# Altium schematic sheet logic6_front.SchDoc: mcHF QRP Transceiver UI board
size A4; Author: K Atanassov; CompanyName: M0NKA; Revision: 0.6.3; SheetTotal: 5
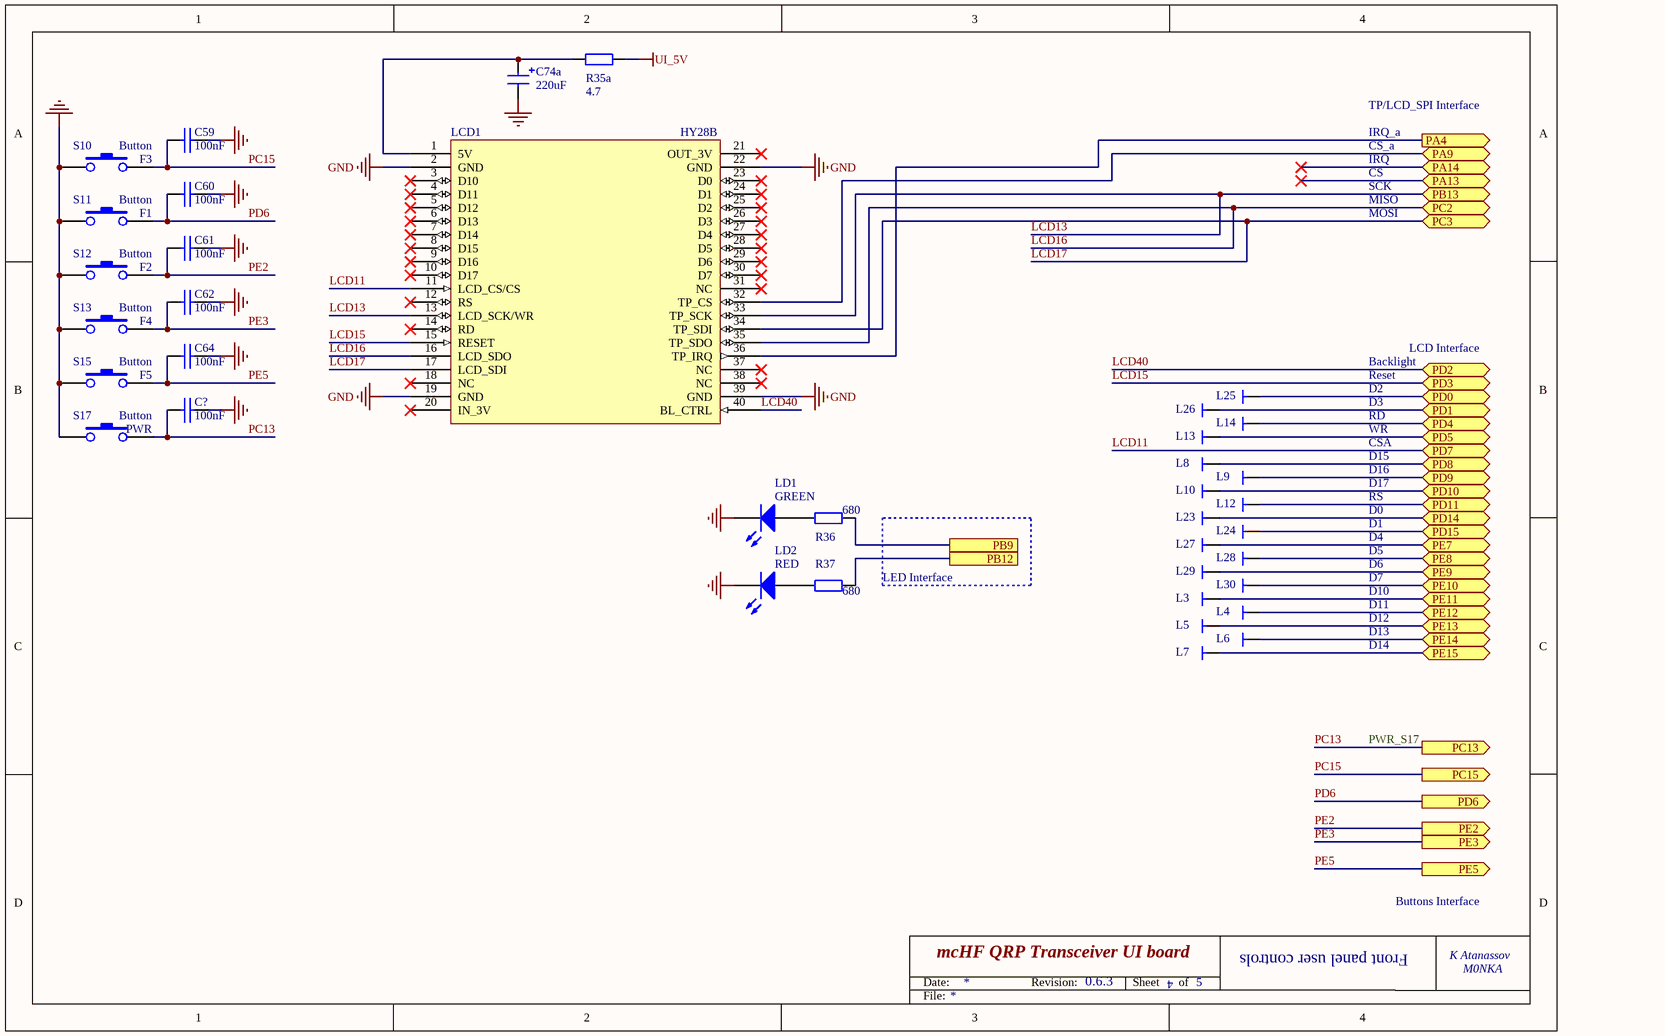
[diagram p0: logic6_front.SchDoc]

## Parts
C59  100nF  [0805-Pro]
C60  100nF  [0805-Pro]
C61  100nF  [0805-Pro]
C62  100nF  [0805-Pro]
C64  100nF  [0805-Pro]
C74a  220uF  [CAP_ALUM]
C?  100nF  [0805-Pro]
L3  TP  [tp]  (value not drawn)  (no BOM)
L4  TP  [tp]  (value not drawn)  (no BOM)
L5  TP  [tp]  (value not drawn)  (no BOM)
L6  TP  [tp]  (value not drawn)  (no BOM)
L7  TP  [tp]  (value not drawn)  (no BOM)
L8  TP  [tp]  (value not drawn)  (no BOM)
L9  TP  [tp]  (value not drawn)  (no BOM)
L10  TP  [tp]  (value not drawn)  (no BOM)
L12  TP  [tp]  (value not drawn)  (no BOM)
L13  TP  [tp]  (value not drawn)  (no BOM)
L14  TP  [tp]  (value not drawn)  (no BOM)
L23  TP  [tp]  (value not drawn)  (no BOM)
L24  TP  [tp]  (value not drawn)  (no BOM)
L25  TP  [tp]  (value not drawn)  (no BOM)
L26  TP  [tp]  (value not drawn)  (no BOM)
L27  TP  [tp]  (value not drawn)  (no BOM)
L28  TP  [tp]  (value not drawn)  (no BOM)
L29  TP  [tp]  (value not drawn)  (no BOM)
L30  TP  [tp]  (value not drawn)  (no BOM)
LCD1  HY28B  [HY28A]  (no BOM)
LD1  GREEN  [LED2n]
LD2  RED  [LED2n]
R35a  4.7  [1206]
R36  680  [0805-Pro]
R37  680  [0805-Pro]
S10  Button  Software function: F3  [BUTTON_SMD2]
S11  Button  Software function: F1  [BUTTON_SMD2]
S12  Button  Software function: F2  [BUTTON_SMD2]
S13  Button  Software function: F4  [BUTTON_SMD2]
S15  Button  Software function: F5  [BUTTON_SMD2]
S17  Button  Software function: PWR  [BUTTON_SMD2]

## Ports
PA4 (out), PA9 (bidir), PA13 (bidir), PA14 (bidir), PB9, PB12, PB13 (bidir), PC2 (bidir), PC3 (bidir), PC13 (out), PC15 (out), PD0 (bidir), PD1 (bidir), PD2 (bidir), PD3 (bidir), PD4 (bidir), PD5 (bidir), PD6 (out), PD7 (bidir), PD8 (bidir), PD9 (bidir), PD10 (bidir), PD11 (bidir), PD14 (bidir), PD15 (bidir), PE2 (out), PE3 (out), PE5 (out), PE7 (bidir), PE8 (bidir), PE9 (bidir), PE10 (bidir), PE11 (bidir), PE12 (bidir), PE13 (bidir), PE14 (bidir), PE15 (bidir)

## Nets
GND: C59.1 C60.1 C61.1 C62.1 C64.1 C74a.2 C?.1 LCD1.2(GND) LCD1.19(GND) LCD1.22(GND) LCD1.39(GND) LD1.2(K) LD2.2(K) S10.1 S11.1 S12.1 S13.1 S15.1 S17.1
UI_5V: R35a.1
LCD11: LCD1.11(LCD_CS/CS) ; port PD7
LCD13: LCD1.13(LCD_SCK/WR) LCD1.33(TP_SCK) ; port PB13
LCD15: LCD1.15(RESET) ; port PD3
LCD16: LCD1.16(LCD_SDO) LCD1.35(TP_SDO) ; port PC2
LCD17: LCD1.17(LCD_SDI) LCD1.34(TP_SDI) ; port PC3
LCD40: LCD1.40(BL_CTRL) ; port PD2
PA4: LCD1.36(TP_IRQ) ; port PA4
PA9: LCD1.32(TP_CS) ; port PA9
PB9: R36.2 ; port PB9
PB12: R37.2 ; port PB12
PC13: C?.2 S17.2 ; port PC13
PC15: C59.2 S10.2 ; port PC15
PD0: L25.1 ; port PD0
PD1: L26.1 ; port PD1
PD4: L14.1 ; port PD4
PD5: L13.1 ; port PD5
PD6: C60.2 S11.2 ; port PD6
PD8: L8.1 ; port PD8
PD9: L9.1 ; port PD9
PD10: L10.1 ; port PD10
PD11: L12.1 ; port PD11
PD14: L23.1 ; port PD14
PD15: L24.1 ; port PD15
PE2: C61.2 S12.2 ; port PE2
PE3: C62.2 S13.2 ; port PE3
PE5: C64.2 S15.2 ; port PE5
PE7: L27.1 ; port PE7
PE8: L28.1 ; port PE8
PE9: L29.1 ; port PE9
PE10: L30.1 ; port PE10
PE11: L3.1 ; port PE11
PE12: L4.1 ; port PE12
PE13: L5.1 ; port PE13
PE14: L6.1 ; port PE14
PE15: L7.1 ; port PE15
NetC74a_1: C74a.1 LCD1.1(5V) R35a.2
NetLD1_1: LD1.1(A) R36.1
NetLD2_1: LD2.1(A) R37.1

Not connected (* = marked no-connect by the designer): LCD1 3(D10)* 4(D11)* 5(D12)* 6(D13)* 7(D14)* 8(D15)* 9(D16)* 10(D17)* 12(RS)* 14(RD)* 18(NC)* 20(IN_3V)* 21(OUT_3V)* 23(D0)* 24(D1)* 25(D2)* 26(D3)* 27(D4)* 28(D5)* 29(D6)* 30(D7)* 31(NC)* 37(NC)* 38(NC)*

## Notes on the sheet
- TP/LCD_SPI Interface
- IRQ
- CS
- IRQ_a
- CS_a
- MISO
- MOSI
- SCK
- Backlight
- Reset
- LCD Interface
- CSA
- WR
- RD
- D2
- D3
- D16
- D15
- D17
- RS
- D0
- (near R37) LED Interface
- D1
- D4
- D5
- D6
- D7
- D10
- D12
- D11
- D13
- D14
- PWR_S17
- Buttons Interface
- 4
- Front panel user controls
- Date:
- Revision:
- Sheet
- of
- File:

## Library data of the parts
C59-C62 C64 C? = CAP: Capacitor; Order: FN 174-0673; QT Order: QCC-00154; Price: 0.068
C74a = CAP-POL: Electrolitic capacitor; Order: FN 225-4321; QT Order: QCC-00320; Price: 0.34
L3-L10 L12-L14 L23-L30 = TP: Test point
LCD1 = HY28AB: 2.8 inch TFT LCD
LD1 = LED2: LED 3mm; Order: FN 211-2096; Revision: July-2002: Re-released for DXP Platform.; Price: 0.116
LD2 = LED2: LED 3mm; Order: FN 211-2100; Revision: July-2002: Re-released for DXP Platform.; Price: 0.148
R35a = RES: Resistor; Order: FN 207-8986; QT Order: QCR-00415; Price: 0.02
R36 R37 = RES: Resistor; Order: FN 933-3460; QT Order: QCR-00321; Price: 0.054
S10-S13 S15 S17 = SW-PB: Push Button; Order: EB 290913735944; Price: 0.14